# Altium schematic sheet [3] - Gas Sensor and ADC.SchDoc: Gas Sensor and ADC
size A4 portrait; ApprovedBy: Team 7; CheckedBy: Charitonidis A.; Author: Charitonidis Alexandros; CompanyName: SMAQ; DrawnBy: Charitonidis A.; Engineer: Charitonidis Alexandros; Organization: SMAQ; Address1: Glasgow; DocumentNumber: SCH-002; Revision: 1.1; SheetNumber: 3; SheetTotal: 6; TeamNumber: 7
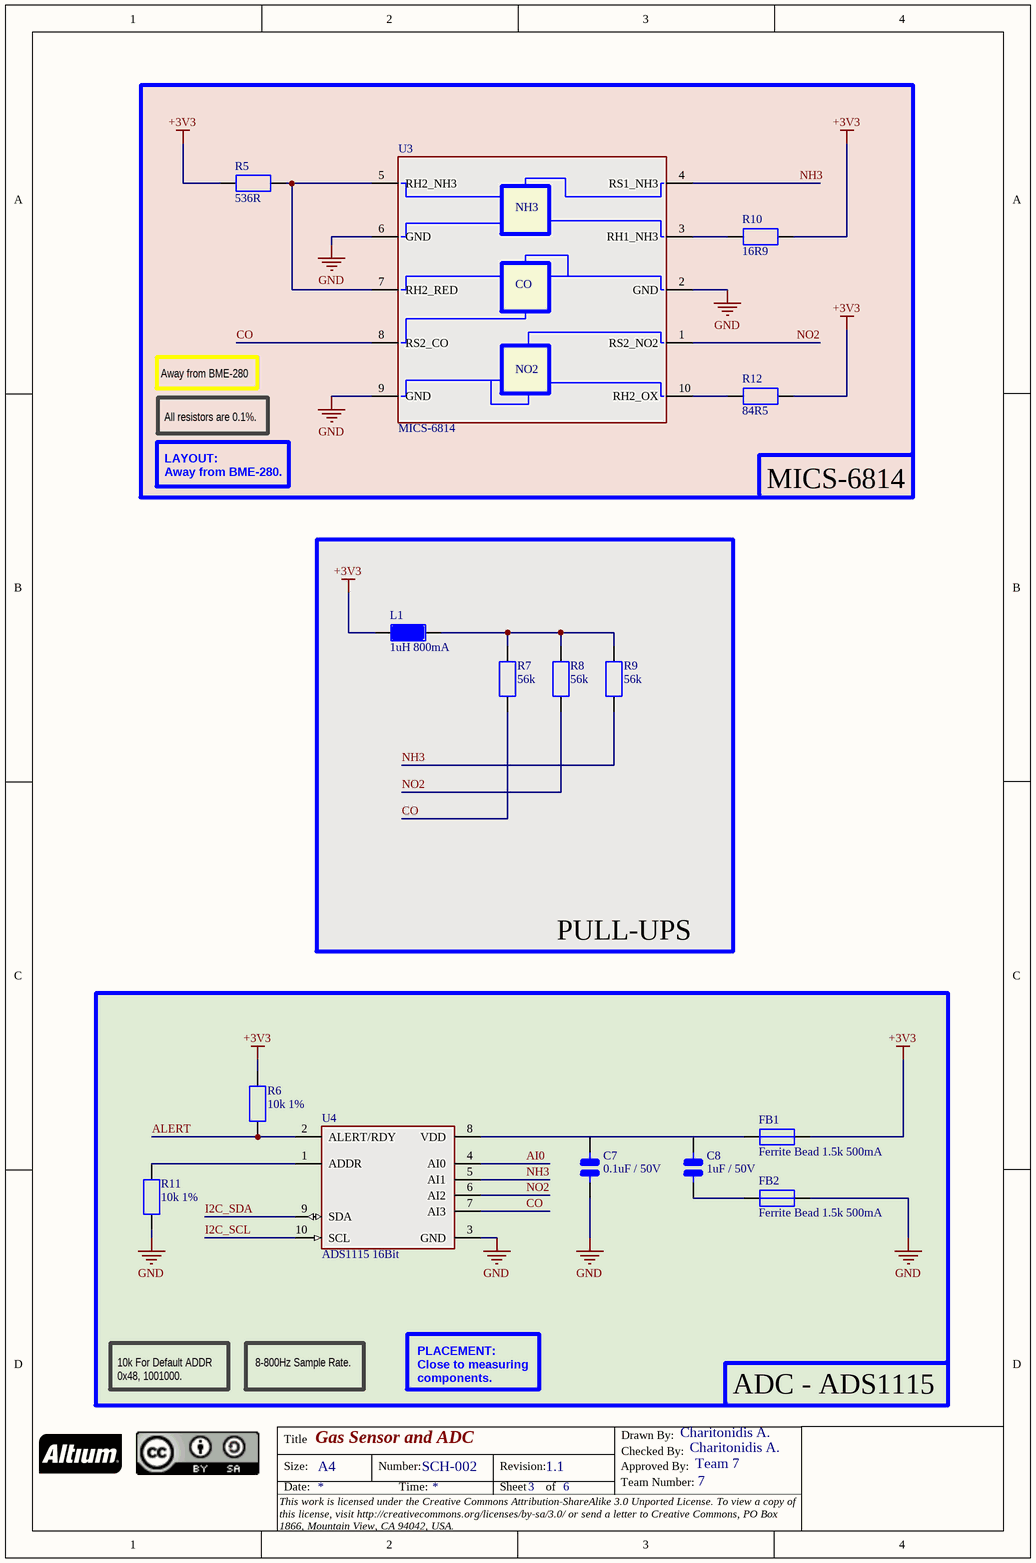
[diagram p0: [3] - Gas Sensor and ADC.SchDoc]

## Parts
C7  0.1uF / 50V  [C0805]  (no BOM)
C8  1uF / 50V  [C0805]  (no BOM)
FB1  Ferrite Bead 1.5k 500mA  [C0805]  (no BOM)
FB2  Ferrite Bead 1.5k 500mA  [C0805]  (no BOM)
L1  1uH 800mA  [C0805]  (no BOM)
R5  536R  [R0805 (2012M)]  (no BOM)
R6  10k 1%  [R0805 (2012M)]  (no BOM)
R7  56k  [R0805 (2012M)]  (no BOM)
R8  56k  [R0805 (2012M)]  (no BOM)
R9  56k  [R0805 (2012M)]  (no BOM)
R10  16R9  [R0805 (2012M)]  (no BOM)
R11  10k 1%  [R0805 (2012M)]  (no BOM)
R12  84R5  [R0805 (2012M)]  (no BOM)
U3  MICS-6814  [MICS-10]  (no BOM)
U4  ADS1115 16Bit  [VSSOP-10]  (no BOM)

## Blocks framed on the sheet
MICS-6814: R5 R10 R12 U3
PULL-UPS: L1 R7-R9
ADC - ADS1115: C7 C8 FB1 FB2 R6 R11 U4

## Nets
+3V3: FB1.2 L1.1 R5.1 R6.2 R10.2 R12.2
GND: C7.1 FB2.2 R11.1 U3.2(GND) U3.6(GND) U3.9(GND) U4.3(GND)
AI0: U4.4(AI0)
ALERT: R6.1 U4.2(ALERT/RDY)
CO: R7.1 U3.8(RS2_CO) U4.7(AI3)
I2C_SCL: U4.10(SCL)
I2C_SDA: U4.9(SDA)
NH3: R9.1 U3.4(RS1_NH3) U4.5(AI1)
NO2: R8.1 U3.1(RS2_NO2) U4.6(AI2)
NetC7_2: C7.2 C8.2 FB1.1 U4.8(VDD)
NetC8_1: C8.1 FB2.1
NetL1_2: L1.2 R7.2 R8.2 R9.2
NetR5_2: R5.2 U3.5(RH2_NH3) U3.7(RH2_RED)
NetR10_1: R10.1 U3.3(RH1_NH3)
NetR11_2: R11.2 U4.1(ADDR)
NetR12_1: R12.1 U3.10(RH2_OX)

## Notes on the sheet
- Away from BME-280
- All resistors are 0.1%.
- LAYOUT:
  Away from BME-280.
- 10k For Default ADDR
  0x48, 1001000.
- 8-800Hz Sample Rate.
- PLACEMENT:
  Close to measuring components.
- Title
- Drawn By:
- Size:
- Date:
- A4
- Number:
- Time:
- Revision:
- Sheet
- of
- Approved By:
- Team Number:
- Checked By:
- This work is licensed under the Creative Commons Attribution-ShareAlike 3.0 Unported License. To view a copy of this license, visit http://creativecommons.org/licenses/by-sa/3.0/ or send a letter to Creative Commons, PO Box 1866, Mountain View, CA 94042, USA.
- (in symbol MICS-6814) NH3; CO; NO2

## Library data of the parts
C7 = 08055C104JAT4A: CAP CER 0.1UF 50V X7R 0805; Manufacturer 1: Kyocera AVX; Category 1: Ceramic Capacitors; Capacitance: 100nF; Tolerance: 5%; Supplier 1: Mouser; Manufacturer Part Number 1: 08055C104JAT4A; RoHS: Yes; Description 1: CAP CER 0.1UF 50V X7R 0805; Stock 1: 70357; Mount: Surface Mount; Case/Package: 0805; Number of Pins: 2; Case Code (Imperial): 0805; Case Code (Metric): 2012; Min Operating Temperature: -55°C; Max Operating Temperature: 125°C; Dielectric: X7R; Package Quantity: 10000; Voltage Rating: 50V; Packaging: Tape and Reel; Termination: SMD/SMT; Voltage Rating (DC): 50V; Length: 2.01mm; Depth: 1.25mm; Width: 0.049inch; Thickness: 0.037inch; Radiation Hardening: No; Lead Free: Lead Free; ComponentLink1URL: https://datasheet.ciiva.com/16326/cx7r-16326437.pdf?src-supplier=Future+Electronics; ComponentLink1Description: https://datasheet.ciiva.com/16326/cx7r-16326437.pdf?src-supplier=Future+Electronics; ComponentLink2URL: https://datasheet.ciiva.com/6277/cx7r-6277722.pdf?src-supplier=Digi-Key; ComponentLink2Description: https://datasheet.ciiva.com/6277/cx7r-6277722.pdf?src-supplier=Digi-Key; Supplier Part Number 1: 581-08055C104JAT4A
C8 = 08055C105JAT2A: Manufacturer 1: Kyocera AVX; Category 1: Capacitors; Dielectric: X7R; Tolerance: 5%; Supplier 1: Mouser; Manufacturer Part Number 1: 08055C105JAT2A; RoHS: No; Stock 1: 5621; Voltage: 50V; Supplier Part Number 1: 581-08055C105JAT2A
FB1 FB2 = MMZ2012Y152B: Ferrite Beads Multi-Layer 1.5KOhm 25% 100MHz 500mA 400mOhm DCR 0805; Manufacturer 1: TDK; Category 1: Inductors; Impedance: 1.5kR; DC Resistance (DCR): 400mR; Shielding: Unshielded; Supplier 1: Farnell; Manufacturer Part Number 1: MMZ2012Y152B; RoHS: Yes; Description 1: Ferrite Beads Multi-Layer 1.5KOhm 25% 100MHz 500mA 400mOhm DCR 0805; Pricing 1: 10=0.05740, 100=0.03680, 500=0.02670, 1000=0.02100, 2000=0.01900, 4000=0.01700, 20000=0.01600 (GBP); Case/Package: 0805; Number of Pins: 2; Case Code (Metric): 2012; Case Code (Imperial): 0805; Core Material: Ferrite; Material: Ferrite; Min Operating Temperature: -55°C; Max Operating Temperature: 125°C; Tolerance: 25%; Packaging: Tape and Reel; Package Quantity: 4000; Max DC Current: 500mA; Termination: SMD/SMT; Current Rating: 500mA; Test Frequency: 100MHz; DC Current: 500mA; Military Standard: Not; Frequency: 100MHz; Length: 2mm; Height: 0.85mm; Width: 1.25mm; Depth: 1.25mm; Radiation Hardening: No; REACH SVHC: No SVHC; Lead Free: Lead Free; ComponentLink1URL: https://datasheet.ciiva.com/11800/0900766b8082f891-11800917.pdf?src-supplier=RSComponents; ComponentLink1Description: https://datasheet.ciiva.com/11800/0900766b8082f891-11800917.pdf?src-supplier=RSComponents; ComponentLink2URL: https://datasheet.ciiva.com/34302/1868995-34302918.pdf?src-supplier=Jameco; ComponentLink2Description: https://datasheet.ciiva.com/34302/1868995-34302918.pdf?src-supplier=Jameco; ComponentLink3URL: https://datasheet.ciiva.com/15160/getdatasheetpartid-77343-15160260.pdf?src-supplier=Verical; ComponentLink3Description: https://datasheet.ciiva.com/15160/getdatasheetpartid-77343-15160260.pdf?src-supplier=Verical; ComponentLink4URL: https://datasheet.ciiva.com/16001/e9412-mmz2012-16001336.pdf?src-supplier=Onlinecomponents.com; ComponentLink4Description: https://datasheet.ciiva.com/16001/e9412-mmz2012-16001336.pdf?src-supplier=Onlinecomponents.com; Supplier Part Number 1: 1301674
L1 = KLZ2012MHR1R0HTD25: FIXED IND 1UH 800MA 130 MOHM SMD; Manufacturer 1: TDK; Supplier 1: Mouser; Manufacturer Part Number 1: KLZ2012MHR1R0HTD25; RoHS: No; Description 1: FIXED IND 1UH 800MA 130 MOHM SMD; Stock 1: 3633; ComponentLink1URL: https://product.tdk.com/info/en/catalog/datasheets/inductor_automotive_decoupling_klz2012-hr_en.pdf?src-supplier=Digi-Key; ComponentLink1Description: https://product.tdk.com/info/en/catalog/datasheets/inductor_automotive_decoupling_klz2012-hr_en.pdf?src-supplier=Digi-Key; Supplier Part Number 1: 810-KLZ2012MHR1R0HTD
R5 = ERA6AEB5360V: RES SMD 536 OHM 0.1% 1/8W 0805; Manufacturer 1: Panasonic; Category 1: Chip SMD Resistors; Power Rating: 125mW; Voltage Rating: 100V; Temperature Coefficient: 25ppm/°C; Supplier 1: Mouser; Manufacturer Part Number 1: ERA6AEB5360V; RoHS: Yes; Description 1: RES SMD 536 OHM 0.1% 1/8W 0805; Stock 1: 8172; Mount: Surface Mount; Case/Package: 0805; Number of Pins: 2; Case Code (Metric): 2012; Case Code (Imperial): 0805; Contact Plating: Tin; Min Operating Temperature: -55°C; Max Operating Temperature: 155°C; Tolerance: 0.1%; Packaging: Tape and Reel; Resistance: 536R; Package Quantity: 1; Composition: Thin Film,Metal Film; Number of Terminations: 2; Termination: SMD/SMT; Military Standard: Not; Max Power Dissipation: 125mW; Voltage Rating (DC): 100V; Features: Automotive AEC-Q200; Length: 2mm; Height: 0.5mm; Width: 1.25mm; Depth: 1.25mm; Radiation Hardening: No; REACH SVHC: No SVHC; Lead Free: Lead Free; ComponentLink1URL: https://datasheet.ciiva.com/11810/0900766b80eb1d8c-11810459.pdf?src-supplier=RSComponents; ComponentLink1Description: https://datasheet.ciiva.com/11810/0900766b80eb1d8c-11810459.pdf?src-supplier=RSComponents; ComponentLink2URL: https://datasheet.ciiva.com/41450/001181222-da-01-en-widerstand-era-0805-536r-0-1-5000st-41450380.pdf?src-supplier=Conrad; ComponentLink2Description: https://datasheet.ciiva.com/41450/001181222-da-01-en-widerstand-era-0805-536r-0-1-5000st-41450380.pdf?src-supplier=Conrad; ComponentLink3URL: https://datasheet.ciiva.com/9181/aoa0000ce26-9181246.pdf?src-supplier=Avnet; ComponentLink3Description: https://datasheet.ciiva.com/9181/aoa0000ce26-9181246.pdf?src-supplier=Avnet; Supplier Part Number 1: 667-ERA-6AEB5360V
R6 R11 = AT0805FRE0710KL: RES SMD 10K OHM 1% 1/8W 0805; Manufacturer 1: Yageo; Category 1: Chip SMD Resistors; Resistance: 10kR; Max Power Dissipation: 125mW; Temperature Coefficient: 50ppm/°C; Supplier 1: Mouser; Manufacturer Part Number 1: AT0805FRE0710KL; RoHS: Yes; Description 1: RES SMD 10K OHM 1% 1/8W 0805; Stock 1: 12821; Case/Package: 0805; Case Code (Metric): 2012; Case Code (Imperial): 0805; Min Operating Temperature: -55°C; Max Operating Temperature: 155°C; Packaging: Tape and Reel; Composition: Thin Film; Number of Terminations: 2; Tolerance: 1%; Features: Moisture Resistant,Automotive AEC-Q200,Anti-Sulfur; Length: 0.079inch; Height: 0.024inch; Width: 0.049inch; ComponentLink1URL: http://www.yageo.com/documents/recent/PYu-AT_51_RoHS_L_5.pdf?src-supplier=Digi-Key; ComponentLink1Description: http://www.yageo.com/documents/recent/PYu-AT_51_RoHS_L_5.pdf?src-supplier=Digi-Key; ComponentLink2URL: http://www.yageo.com/documents/recent/PYu-AT_51_RoHS_L-3.pdf?src-supplier=Digi-Key; ComponentLink2Description: http://www.yageo.com/documents/recent/PYu-AT_51_RoHS_L-3.pdf?src-supplier=Digi-Key; Supplier Part Number 1: 603-AT0805FRE0710KL
R7-R9 = ERA-6AEB563V: RES SMD 56K OHM 0.1% 1/8W 0805; Manufacturer 1: Panasonic; Category 1: Chip SMD Resistors; Resistance: 56kR; Temperature Coefficient: 25ppm/°C; Power Rating: 125mW; Voltage Rating: 100V; Supplier 1: Mouser; Manufacturer Part Number 1: ERA-6AEB563V; RoHS: Yes; Description 1: RES SMD 56K OHM 0.1% 1/8W 0805; Stock 1: 14319; Mount: Surface Mount; Case/Package: 0805; Number of Pins: 2; Contact Plating: Tin; Case Code (Metric): 2012; Case Code (Imperial): 0805; Min Operating Temperature: -55°C; Max Operating Temperature: 155°C; Composition: Thin Film; Tolerance: 0.1%; Packaging: Tape and Reel; Package Quantity: 1; Termination: SMD/SMT; Number of Terminations: 2; Military Standard: Not; Max Power Dissipation: 125mW; Voltage Rating (DC): 100V; Features: Automotive AEC-Q200; Length: 2mm; Height: 0.5mm; Width: 1.25mm; Depth: 1.25mm; Radiation Hardening: No; REACH SVHC: No SVHC; Lead Free: Lead Free; ComponentLink1URL: https://datasheet.ciiva.com/11815/0900766b80beefcc-11815835.pdf?src-supplier=RSComponents; ComponentLink1Description: https://datasheet.ciiva.com/11815/0900766b80beefcc-11815835.pdf?src-supplier=RSComponents; ComponentLink2URL: https://datasheet.ciiva.com/26335/453572-da-01-en-widerstand-0805-era-26335719.pdf?src-supplier=Conrad; ComponentLink2Description: https://datasheet.ciiva.com/26335/453572-da-01-en-widerstand-0805-era-26335719.pdf?src-supplier=Conrad; ComponentLink3URL: https://datasheet.ciiva.com/6138/485442-6138597.pdf?src-supplier=Farnell; ComponentLink3Description: https://datasheet.ciiva.com/6138/485442-6138597.pdf?src-supplier=Farnell; ComponentLink4URL: https://datasheet.ciiva.com/48530/era-eng-tds-48530021.pdf?src-supplier=Distrelec; ComponentLink4Description: https://datasheet.ciiva.com/48530/era-eng-tds-48530021.pdf?src-supplier=Distrelec; ComponentLink5URL: https://datasheet.ciiva.com/6138/485442-6138602.pdf?src-supplier=Farnell; ComponentLink5Description: https://datasheet.ciiva.com/6138/485442-6138602.pdf?src-supplier=Farnell; ComponentLink6URL: https://datasheet.ciiva.com/7886/485442-7886650.pdf?src-supplier=Element14; ComponentLink6Description: https://datasheet.ciiva.com/7886/485442-7886650.pdf?src-supplier=Element14; ComponentLink7URL: https://datasheet.ciiva.com/7886/485442-7886651.pdf?src-supplier=Element14; ComponentLink7Description: https://datasheet.ciiva.com/7886/485442-7886651.pdf?src-supplier=Element14; ComponentLink8URL: https://datasheet.ciiva.com/30221/54aoa0000ce26-30221499.pdf?src-supplier=Onlinecomponents.com; ComponentLink8Description: https://datasheet.ciiva.com/30221/54aoa0000ce26-30221499.pdf?src-supplier=Onlinecomponents.com; ComponentLink9URL: https://datasheet.ciiva.com/6138/485442-6138604.pdf?src-supplier=Farnell; ComponentLink9Description: https://datasheet.ciiva.com/6138/485442-6138604.pdf?src-supplier=Farnell; ComponentLink10URL: https://datasheet.ciiva.com/7886/485442-7886652.pdf?src-supplier=Element14; ComponentLink10Description: https://datasheet.ciiva.com/7886/485442-7886652.pdf?src-supplier=Element14; ComponentLink11URL: https://datasheet.ciiva.com/17209/aoa0000ce26-17209230.pdf?src-supplier=Avnet+Europe; ComponentLink11Description: https://datasheet.ciiva.com/17209/aoa0000ce26-17209230.pdf?src-supplier=Avnet+Europe; Supplier Part Number 1: 667-ERA-6AEB563V
R10 = ERJ-P06F17R4V: Res Thick Film 0805 16.9 Ohm 1% 1/4W 300ppm/C Molded SMD Punched Carrier T/R; Manufacturer 1: Panasonic; Description 1: Res Thick Film 0805 17.4 Ohm 1% 1/4W 300ppm/C Molded SMD Punched Carrier T/R; Category 1: Chip SMD Resistors; Resistance: 17.4R; Power Rating: 500mW; Voltage Rating: 150V; Temperature Coefficient: 300ppm/°C; Voltage Rating (DC): 400V; Manufacturer Part Number 1: ERJ-P06F17R4V; RoHS: Yes; Mount: Surface Mount; Case/Package: 0805; Case Code (Imperial): 0805; Case Code (Metric): 2012; Min Operating Temperature: -55°C; Max Operating Temperature: 155°C; Tolerance: 1%; Packaging: Tape and Reel; Package Quantity: 5000; Composition: Thick Film; Termination: SMD/SMT; Length: 2mm; Height: 0.6mm; Width: 1.2mm; REACH SVHC: No SVHC; ComponentLink1URL: https://datasheet.ciiva.com/24064/aoa0000ce4-64075-24064442.pdf?src-supplier=Mouser; ComponentLink1Description: https://datasheet.ciiva.com/24064/aoa0000ce4-64075-24064442.pdf?src-supplier=Mouser; ComponentLink2URL: https://datasheet.ciiva.com/22720/1801181-22720492.pdf?src-supplier=Element14; ComponentLink2Description: https://datasheet.ciiva.com/22720/1801181-22720492.pdf?src-supplier=Element14; Supplier 1: Mouser; Supplier Part Number 1: 667-ERJ-P06D17R4V
R12 = ERA-6AEB84R5V: RES SMD 84.5 OHM 0.1% 1/8W 0805; Manufacturer 1: Panasonic; Category 1: Chip SMD Resistors; Resistance: 84.5R; Temperature Coefficient: 25ppm/°C; Power Rating: 125mW; Voltage Rating: 100V; Supplier 1: Mouser; Manufacturer Part Number 1: ERA-6AEB84R5V; RoHS: Yes; Description 1: RES SMD 84.5 OHM 0.1% 1/8W 0805; Stock 1: 6145; Mount: Surface Mount; Case/Package: 0805; Number of Pins: 2; Contact Plating: Tin; Case Code (Imperial): 0805; Case Code (Metric): 2012; Min Operating Temperature: -55°C; Max Operating Temperature: 155°C; Tolerance: 0.1%; Composition: Metal Film,Thin Film; Packaging: Tape and Reel; Package Quantity: 1; Termination: SMD/SMT; Number of Terminations: 2; Max Power Dissipation: 125mW; Voltage Rating (DC): 100V; Features: Automotive AEC-Q200; Length: 2mm; Height: 0.5mm; Width: 1.25mm; Depth: 1.25mm; Radiation Hardening: No; Lead Free: Lead Free; ComponentLink1URL: https://datasheet.ciiva.com/11815/0900766b80eb1d8c-11815865.pdf?src-supplier=RSComponents; ComponentLink1Description: https://datasheet.ciiva.com/11815/0900766b80eb1d8c-11815865.pdf?src-supplier=RSComponents; ComponentLink2URL: https://datasheet.ciiva.com/41450/001181159-da-01-en-widerstand-era-0805-84r5-0-1-5000st-41450316.pdf?src-supplier=Conrad; ComponentLink2Description: https://datasheet.ciiva.com/41450/001181159-da-01-en-widerstand-era-0805-84r5-0-1-5000st-41450316.pdf?src-supplier=Conrad; ComponentLink3URL: https://datasheet.ciiva.com/6075/485442-6075305.pdf?src-supplier=Farnell; ComponentLink3Description: https://datasheet.ciiva.com/6075/485442-6075305.pdf?src-supplier=Farnell; ComponentLink4URL: https://datasheet.ciiva.com/9187/aoa0000ce26-9187305.pdf?src-supplier=Avnet; ComponentLink4Description: https://datasheet.ciiva.com/9187/aoa0000ce26-9187305.pdf?src-supplier=Avnet; ComponentLink5URL: https://datasheet.ciiva.com/6075/485442-6075306.pdf?src-supplier=Farnell; ComponentLink5Description: https://datasheet.ciiva.com/6075/485442-6075306.pdf?src-supplier=Farnell; ComponentLink6URL: https://datasheet.ciiva.com/6075/485442-6075307.pdf?src-supplier=Farnell; ComponentLink6Description: https://datasheet.ciiva.com/6075/485442-6075307.pdf?src-supplier=Farnell; Supplier Part Number 1: 667-ERA-6AEB84R5V
U3 = MICS-6814: SHUT HEIGHT GAGE(119.5MM); Manufacturer 1: SGX Sensortech; Supplier 1: Farnell; Manufacturer Part Number 1: MICS-6814; RoHS: No; Description 1: SHUT HEIGHT GAGE(119.5MM); Pricing 1: 1=15.34000, 5=14.06000, 10=12.78000, 25=11.83000 (GBP); Supplier Part Number 1: 2925869
U4 = ADS1115IDGSR: IC ADC 16BIT 860SPS LP 10MSOP; Manufacturer 1: Texas Instruments; Category 1: Analog to Digital Converters (ADCs); Interface: I2C; Number of Bits: 16; Sampling Rate: 860S/s; Number of A/D Converters: 1; Resolution: 16b; Polarity: Bipolar; Min Supply Voltage: 2V; Max Supply Voltage: 5.5V; Supply Type: Single; Conversion Rate: 0.86KS/s; Number of Inputs: 4; Integral Nonlinearity (INL): 1LSB; Power Dissipation: 900uW; Supplier 1: Mouser; Manufacturer Part Number 1: ADS1115IDGSR; RoHS: Yes; Description 1: IC ADC 16BIT 860SPS LP 10MSOP; Stock 1: 14706; Case/Package: VSSOP; Number of Pins: 10; Contact Plating: Gold; Min Operating Temperature: -40°C; Max Operating Temperature: 125°C; Package Quantity: 2500; Packaging: Tape and Reel; Number of Converters: 1; Max Supply Voltage (DC): 5.5V; Min Supply Voltage (DC): 2V; Radiation Hardening: No; REACH SVHC: No SVHC; Lead Free: Lead Free; ComponentLink1URL: https://datasheet.ciiva.com/4031/47725463s8438921n7713-4031028.pdf?src-supplier=Arrow; ComponentLink1Description: https://datasheet.ciiva.com/4031/47725463s8438921n7713-4031028.pdf?src-supplier=Arrow; ComponentLink2URL: https://datasheet.ciiva.com/25993/sbas444b-25993205.pdf?src-supplier=Avnet+Europe; ComponentLink2Description: https://datasheet.ciiva.com/25993/sbas444b-25993205.pdf?src-supplier=Avnet+Europe; ComponentLink3URL: https://datasheet.ciiva.com/1304/ads1113-1304266.pdf?src-supplier=Digi-Key; ComponentLink3Description: https://datasheet.ciiva.com/1304/ads1113-1304266.pdf?src-supplier=Digi-Key; Supplier Part Number 1: 595-ADS1115IDGSR